# EAGLE design zephyreye_rev2 (EAGLE 5.06)
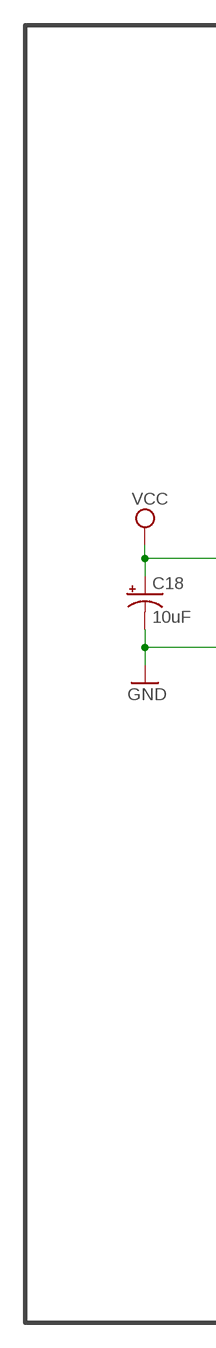
[diagram p0: schematic, sheet 1, part 1 of 2]
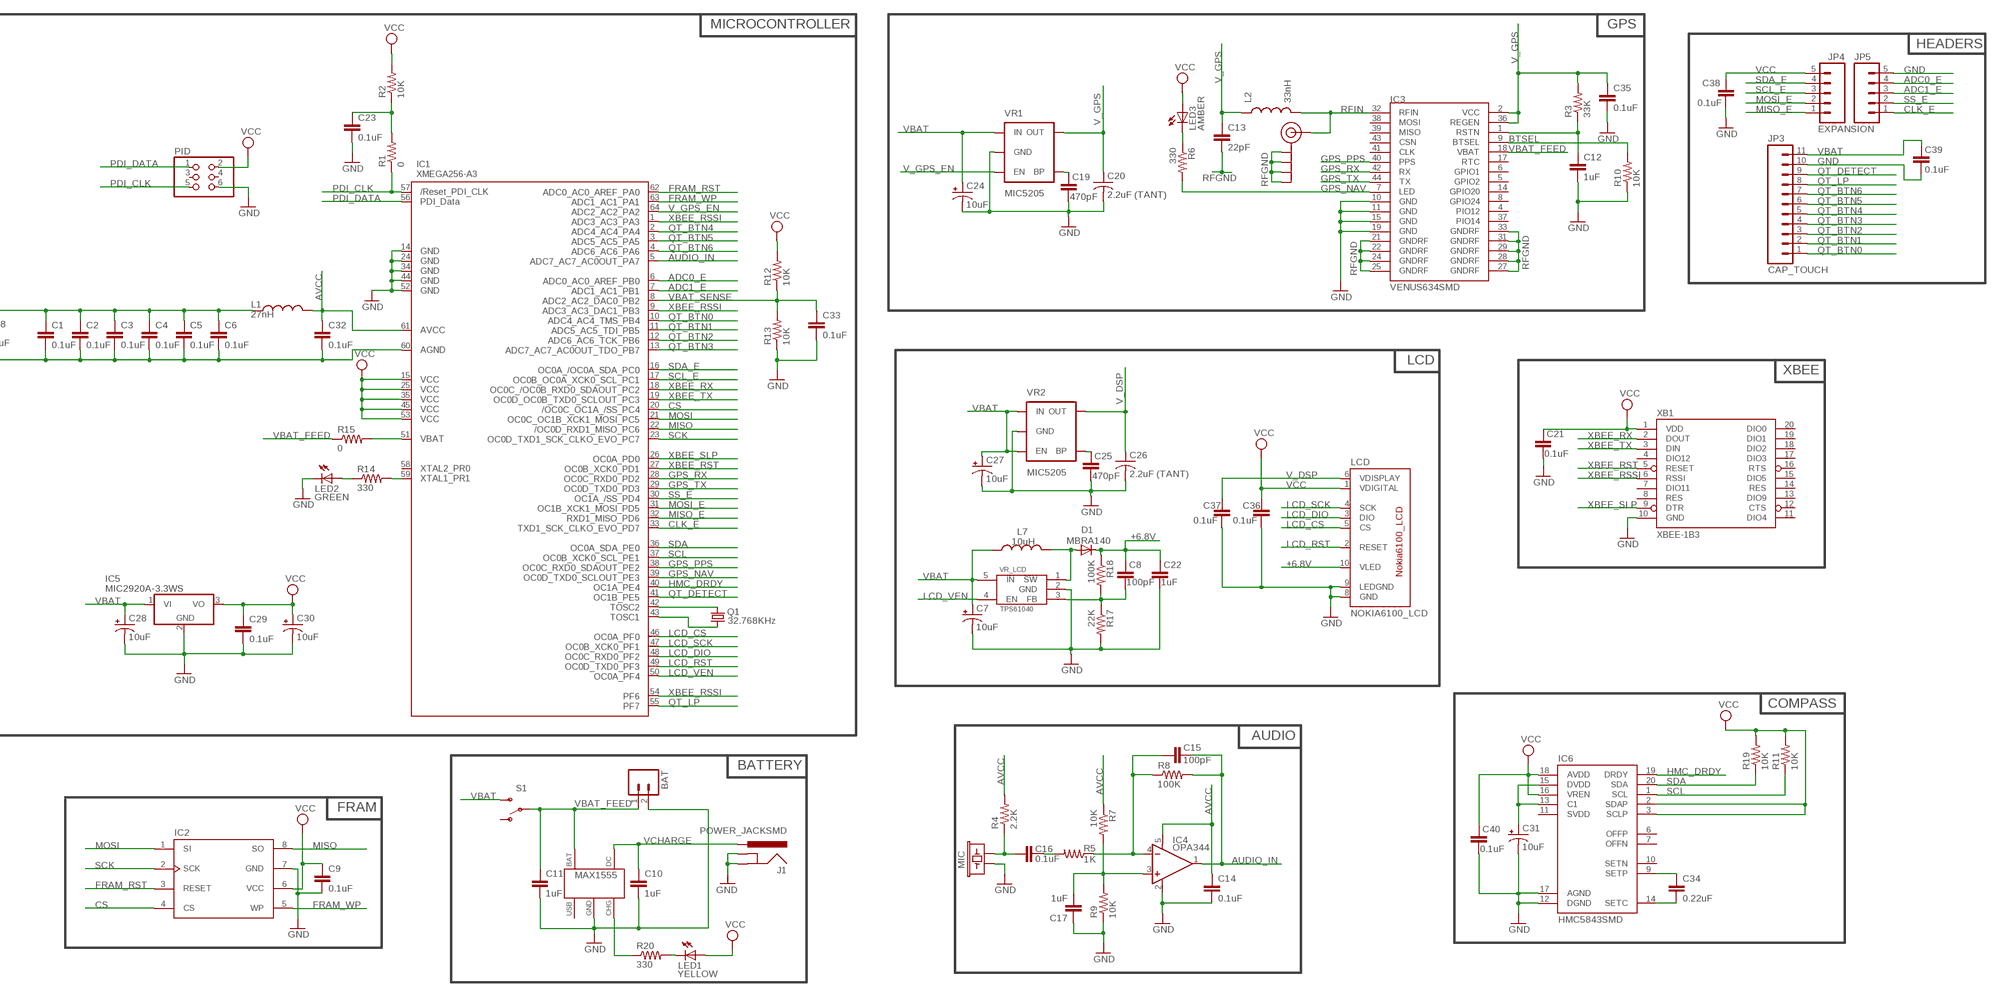
[diagram p1: schematic, sheet 1, part 2 of 2]

## Parts
ANT1  SMA_EDGE  [SMA-EDGE]
BAT  M02-JST-2MM-SMT  [S2B-PH]
C1  0.1uF  CAP0402  [C0402]
C2  0.1uF  CAP0402  [C0402]
C3  0.1uF  CAP0402  [C0402]
C4  0.1uF  CAP0402  [C0402]
C5  0.1uF  CAP0402  [C0402]
C6  0.1uF  CAP0402  [C0402]
C7  10uF  CAP_POL1206  [EIA3216]
C8  100pF  CAP0402  [C0402]
C9  0.1uF  CAP0402  [C0402]
C10  1uF  CAP0402  [C0402]
C11  1uF  CAP0402  [C0402]
C12  1uF  CAP0402  [C0402]
C13  22pF  CAP0402  [C0402]
C14  0.1uF  CAP0402  [C0402]
C15  100pF  CAP0402  [C0402]
C16  0.1uF  CAP0402  [C0402]
C17  1uF  CAP0402  [C0402]
C18  10uF  CAP_POL1206  [EIA3216]
C19  470pF  CAP0402  [C0402]
C20  2.2uF (TANT)  C-USC0603K  [C0603K]
C21  0.1uF  CAP0402  [C0402]
C22  1uF  CAP0402  [C0402]
C23  0.1uF  CAP0402  [C0402]
C24  10uF  CAP_POL1206  [EIA3216]
C25  470pF  CAP0402  [C0402]
C26  2.2uF (TANT)  C-USC0603K  [C0603K]
C27  10uF  CAP_POL1206  [EIA3216]
C28  10uF  CAP_POL1206  [EIA3216]
C29  0.1uF  CAP0402  [C0402]
C30  10uF  CAP_POL1206  [EIA3216]
C31  10uF  CAP_POL1206  [EIA3216]
C32  0.1uF  CAP0402  [C0402]
C33  0.1uF  CAP0402  [C0402]
C34  0.22uF  CAP0402  [C0402]
C35  0.1uF  CAP0402  [C0402]
C36  0.1uF  CAP0402  [C0402]
C37  0.1uF  CAP0402  [C0402]
C38  0.1uF  CAP0402  [C0402]
C39  0.1uF  CAP0402  [C0402]
C40  0.1uF  CAP0402  [C0402]
D1  MBRA140  DIODE-DO214AC  [DO214AC]
IC1  XMEGA256-A3  AVR_XMEGA_A3B_64A  [TQFP64]
IC2  FRAM  ATMEL_DATA_FLASH  [SO08WIDE]
IC3  VENUS634SMD  [LGA44]
IC4  OPA344  [SOT23-5]
IC5  MIC2920A-3.3WS  MCP1703DB  [SOT223]
IC6  HMC5843SMD  [LPCC20]
J1  POWER_JACKSMD  [POWER_JACK_SMD]
JP3  CAP_TOUCH  M111.27MM  [1X11-1.27MM]
JP4  EXPANSION  M051.27MM  [1X05-1.27MM]
JP5  M051.27MM  [1X05-1.27MM]
L1  27nH  INDUCTOR0402  [C0402]
L2  33nH  INDUCTOR0402  [C0402]
L7  10uH  INDUCTOR0603  [0603]
LCD  NOKIA6100_LCD  [NOKIA6100_LCD]
LED1  YELLOW  LED0603  [LED-0603]
LED2  GREEN  LED0603  [LED-0603]
LED3  AMBER  LED0603  [LED-0603]
MAX1555  MAX1555  [SOT23-5]
MIC  MIC9.7MM  [MIC-9.7MM]
PID  PINHD-2X3  [2X03]
Q1  32.768KHz  CRYSTAL32-SMD  [CRYSTAL-32KHZ-SMD]
R1  0  RESISTOR0402  [C0402]
R2  10K  RESISTOR0402  [C0402]
R3  33K  RESISTOR0402  [C0402]
R4  2.2K  RESISTOR0402  [C0402]
R5  1K  RESISTOR0402  [C0402]
R6  330  RESISTOR0402  [C0402]
R7  10K  RESISTOR0402  [C0402]
R8  100K  RESISTOR0402  [C0402]
R9  10K  RESISTOR0402  [C0402]
R10  10K  RESISTOR0402  [C0402]
R11  10K  RESISTOR0402  [C0402]
R12  10K  RESISTOR0402  [C0402]
R13  10K  RESISTOR0402  [C0402]
R14  330  RESISTOR0402  [C0402]
R15  0  RESISTOR0402  [C0402]
R17  22K  RESISTOR0402  [C0402]
R18  100K  RESISTOR0402  [C0402]
R19  10K  RESISTOR0402  [C0402]
R20  330  RESISTOR0402  [C0402]
S1  SWITCH-SPSTSMD2  [SWITCH-SPDT-SMD]
VR1  MIC5205  V_REG_LDOSMD  [SOT23-5]
VR2  MIC5205  V_REG_LDOSMD  [SOT23-5]
VR_LCD  TPS61040  [SOT23-5]
XB1  XBEE-1B3  [XBEE-SMD]

## Nets
+6.8V: C8.2 C22.2 D1.C LCD.10(VLED) R18.1
ADC0_E: IC1.6(PB0) JP5.4
ADC1_E: IC1.7(PB1) JP5.3
AUDIO_IN: C15.2 IC1.5(PA7) IC4.1(OUT) R8.2
AVCC: C14.1 C32.1 IC1.61(AVCC) IC4.5(V+) L1.2 R4.2 R7.1
BTSEL: IC3.9(BTSEL) R10.2
CHG: MAX1555.3(CHG) R20.1
CHRG_LED_FEED: LED1.C R20.2
CLK_E: IC1.33(PD7) JP5.1
CS: IC1.20(PC4) IC2.4(CS)
FRAM_RST: IC1.62(PA0) IC2.3(RESET)
FRAM_WP: IC1.63(PA1) IC2.5(WP)
GND: BAT.2 C1.2 C2.2 C3.2 C4.2 C5.2 C6.2 C7.C(-) C9.2 C10.2 C11.2 C12.2 C14.2 C17.1 C18.C(-) C19.2 C20.2 C21.2 C22.1 C23.2 C24.C(-) C25.2 C26.2 C27.C(-) C28.C(-) C29.2 C30.C(-) C31.C(-) C32.2 C33.2 C35.2 C36.1 C37.1 C38.2 C39.2 C40.2 IC1.14(GND1) IC1.24(GND2) IC1.34(GND3) IC1.44(GND4) IC1.52(GND5) IC1.60(AGND) IC2.7(GND) IC3.10(GND) IC3.11(GND) IC3.15(GND) IC3.19(GND) IC4.2(V-) IC5.2(GND) IC6.12(DGND) IC6.17(AGND) J1.GND(GNDBREAK) J1.P$4(GND) JP3.10 JP5.5 LCD.8(GND) LCD.9(LEDGND) LED2.C MAX1555.2(GND) MIC.1 PID.6 R9.1 R10.1 R13.1 R17.2 VR1.2(GND) VR2.2(GND) VR_LCD.2(GND) XB1.10(GND)
GPS_NAV: IC1.39(PE3) IC3.7(LED) R6.2
GPS_PPS: IC1.38(PE2) IC3.40(PPS)
GPS_RX: IC1.28(PD2) IC3.42(RX)
GPS_TX: IC1.29(PD3) IC3.44(TX)
HMC_DRDY: IC1.40(PE4) IC6.19(DRDY)
HMC_DVDD: C31.A(+) IC6.13(C1) IC6.15(DVDD)
HMC_SETC: C34.2 IC6.14(SETC)
HMC_SETP: C34.1 IC6.9(SETP)
LCD_CS: IC1.46(PF0) LCD.5(CS)
LCD_DIO: IC1.48(PF2) LCD.3(DIO)
LCD_RST: IC1.49(PF3) LCD.2(RESET)
LCD_SCK: IC1.47(PF1) LCD.4(SCK)
LCD_VEN: IC1.50(PF4) VR_LCD.4(EN)
LED3_FEED: LED3.C R6.1
MCU_LED: IC1.59(PR1) R14.2
MIC_FILT1: C16.2 R5.2
MIC_OPAMP_IN: C15.1 IC4.4(-IN) R5.1 R8.1
MIC_OPAMP_VIRT_GND: C17.2 IC4.3(+IN) R7.2 R9.2
MIC_RAW: C16.1 MIC.2 R4.1
MISO: IC1.22(PC6) IC2.8(SO)
MISO_E: IC1.32(PD6) JP4.1
MOSI: IC1.21(PC5) IC2.1(SI)
MOSI_E: IC1.31(PD5) JP4.2
N$1: IC1.51(VBAT) R15.2
N$3: LED2.A R14.1
PDI_CLK: IC1.57(RESET) PID.5 R1.1
PDI_DATA: IC1.56(PDI_DATA) PID.1
QT_BTN0: IC1.10(PB4) JP3.1
QT_BTN1: IC1.11(PB5) JP3.2
QT_BTN2: IC1.12(PB6) JP3.3
QT_BTN3: IC1.13(PB7) JP3.4
QT_BTN4: IC1.2(PA4) JP3.5
QT_BTN5: IC1.3(PA5) JP3.6
QT_BTN6: IC1.4(PA6) JP3.7
QT_DETECT: IC1.41(PE5) JP3.9
QT_LP: IC1.55(PF7) JP3.8
RFGND: ANT1.GND@0(GND) ANT1.GND@1(GND) ANT1.GND@2(GND) ANT1.GND@3(GND) C13.2 IC3.21(GNDRF) IC3.22(GNDRF) IC3.24(GNDRF) IC3.25(GNDRF) IC3.27(GNDRF) IC3.28(GNDRF) IC3.29(GNDRF) IC3.31(GNDRF) IC3.33(GNDRF)
RFIN: ANT1.SIG(SIGNAL) IC3.32(RFIN) L2.2
RST_FEED: C23.1 R1.2 R2.1
RSTN: C12.1 IC3.1(RSTN) R3.1
SCK: IC1.23(PC7) IC2.2(SCK)
SCL: IC1.37(PE1) IC6.1(SCL) R11.1
SCL_E: IC1.17(PC1) JP4.3
SDA: IC1.36(PE0) IC6.20(SDA) R19.1
SDA_E: IC1.16(PC0) JP4.4
SS_E: IC1.30(PD4) JP5.2
TOSC1: IC1.43(TOSC1) Q1.X1
TOSC2: IC1.42(TOSC2) Q1.X2
V_DSP: C26.1 C37.2 LCD.6(VDISPLAY) VR2.5(OUT)
V_GPS: C13.1 C20.1 C35.1 IC3.2(VCC) IC3.36(REGEN) L2.1 R3.2 VR1.5(OUT)
V_GPS_EN: IC1.64(PA2) VR1.3(EN)
VBAT: C7.A(+) C24.A(+) C27.A(+) C28.A(+) C39.1 IC5.1(VI) JP3.11 L7.1 S1.3(S) VR1.1(IN) VR2.1(IN) VR2.3(EN) VR_LCD.5(IN)
VBAT_FEED: BAT.1 C11.1 IC3.18(VBAT) MAX1555.5(BAT) R15.1 S1.2(P)
VBAT_SENSE: C33.1 IC1.8(PB2) R12.1 R13.2
VCC: C1.1 C2.1 C3.1 C4.1 C5.1 C6.1 C9.1 C18.A(+) C21.1 C29.1 C30.A(+) C36.2 C38.1 C40.1 IC1.15(VCC1) IC1.25(VCC2) IC1.35(VCC3) IC1.45(VCC4) IC1.53(VCC5) IC2.6(VCC) IC5.3(VO) IC6.2(SDAP) IC6.3(SCLP) IC6.16(VREN) IC6.18(AVDD) JP4.5 L1.1 LCD.1(VDIGITAL) LED1.A LED3.A PID.2 R2.2 R11.2 R12.2 R19.2 XB1.1(VDD)
VCHARGE: C10.1 J1.VIN0(PWR) MAX1555.4(DC)
VR1_BP: C19.1 VR1.4(BP)
VR1_BP1: C25.1 VR2.4(BP)
VR_LCD_FB: C8.1 R17.1 R18.2 VR_LCD.3(FB)
VR_LCD_SW: D1.A L7.2 VR_LCD.1(SW)
XBEE_RSSI: IC1.1(PA3) IC1.9(PB3) IC1.54(PF6) XB1.6(RSSI)
XBEE_RST: IC1.27(PD1) XB1.5(RESET)
XBEE_RX: IC1.18(PC2) XB1.2(DOUT)
XBEE_SLP: IC1.26(PD0) XB1.9(DTR)
XBEE_TX: IC1.19(PC3) XB1.3(DIN)
Unconnected: IC1.58(PR0) IC3.4(PIO12) IC3.5(GPIO2) IC3.6(GPIO1) IC3.8(GPIO24) IC3.14(GPIO20) IC3.17(RTC) IC3.37(PIO14) IC3.38(MOSI) IC3.39(MISO) IC3.41(CLK) IC3.43(CSN) IC6.6(OFFP) IC6.7(OFFN) IC6.10(SETN) IC6.11(SVDD) MAX1555.1(USB) PID.3 PID.4 S1.1(O) XB1.4(DIO12) XB1.7(DIO11) XB1.8(RES) XB1.11(DIO4) XB1.12(CTS) XB1.13(DIO9) XB1.14(RES) XB1.15(DIO5) XB1.16(RTS) XB1.17(DIO3) XB1.18(DIO2) XB1.19(DIO1) XB1.20(DIO0)

## Notes on the sheet
- MICROCONTROLLER | GPS
- HEADERS
- LCD
- XBEE
- COMPASS
- AUDIO
- BATTERY
- FRAM

## Library data of the parts
ANT1 = SparkFun:SMA_EDGE: SMA Antenna Connector End launch SMA connector. The paste layer has been removed so that the connector can be hand soldered onto the board after reflow.
BAT = SparkFun:M02: Header 2 Standard 2-pin 0.1" header. Use with straight break away headers (SKU : PRT-00116), right angle break away headers (PRT-00553), swiss pins (PRT-00743), machine pins (PRT-00117), and female headers (PRT-00115). Molex polarized connector foot print use with SKU : PRT-08233 with associated crimp pins and housings.
C1-C6 C8-C17 C19 C21-C23 C25 C29 C32-C40 = SparkFun:CAP: Capacitor Standard 0603 ceramic capacitor, and 0.1" leaded capacitor.
C7 C24 C27 C28 C30 C31 = SparkFun-3-2-07:CAP_POL: Capacitor Polarized These are standard SMD and PTH capacitors. Normally 10uF, 47uF, and 100uF in electrolytic and tantalum varieties. Always verify the external diameter of the through hole cap, it varies with capacity, voltage, and manufacturer. The EIA devices should be standard.
C18 = SparkFun:CAP_POL: Capacitor Polarized These are standard SMD and PTH capacitors. Normally 10uF, 47uF, and 100uF in electrolytic and tantalum varieties. Always verify the external diameter of the through hole cap, it varies with capacity, voltage, and manufacturer. The EIA devices should be standard.
C20 C26 = rcl:C-US: CAPACITOR, American symbol
D1 = diode:DIODE-: DIODE
IC1 = xmega:AVR_XMEGA_A3B_: Device for Atmel AVR XMEGA A3B Series
IC2 = SparkFunEagle-6-6-07:ATMEL_DATA_FLASH: 16Mbit EEPROM DataFlash Footprint needs touching up. Spark Fun Electronics SKU : COM-00301
IC3 = SparkFun:VENUS634: Venus634 from SkyTraq
IC4 = SparkFun:OPA344
IC5 = linear:MCP1703: 250 mA, 16V, Low Quiescent Current LDO Regulator Source: http://ww1.microchip.com/downloads/en/DeviceDoc/22049b.pdf
IC6 = SparkFun:HMC5843
J1 = SparkFun:POWER_JACK: Power Jack This is the standard 5.5mm barrel jack for power. The PTH is the most common, proven, reliable, footprint. All others are experimental. The Slot footprint only works if the mill layer is transmitted to the PCB fab house so be warned. Spark Fun Electronics SKU : PRT-00119. Mating wall wart : TOL-00298 (and others)
JP3 = SparkFun:M11: Header 11 Standard 11-pin 0.1" header. Use with straight break away headers (SKU : PRT-00116), right angle break away headers (PRT-00553), swiss pins (PRT-00743), machine pins (PRT-00117), and female headers (PRT-00115).
JP4 JP5 = SparkFun:M05: Header 5 Standard 5-pin 0.1" header. Use with straight break away headers (SKU : PRT-00116), right angle break away headers (PRT-00553), swiss pins (PRT-00743), machine pins (PRT-00117), and female headers (PRT-00115). Molex polarized connector foot print use with SKU : PRT-08230 with associated crimp pins and housings.
L1 L2 = SparkFun:INDUCTOR: Inductors Basic Inductor/Choke - 0603 and 1206. Footprints are not proven and vary greatly between part numbers.
L7 = SparkFun-3-2-07:INDUCTOR: Inductors Basic Inductor/Choke - 0603 and 1206. Footprints are not proven and vary greatly between part numbers.
LCD = SparkFun:NOKIA6100_LCD: Nokia 6100 Color LCD Schematic element and footprint production proven but could use some touching up. Spark Fun Electronics SKU : LCD-00569. Mating SMD connector : LCD-00570
LED1-LED3 = SparkFun:LED: LEDs Standard schematic elements and footprints for 5mm, 3mm, 1206, and 0603 sized LEDs. 5mm - Spark Fun Electronics SKU : COM-00529 (and others)
MAX1555 = brad:MAX1555
MIC = SparkFun:MIC: Microphone Omni-directional electret microphone. 9.7mm standard diameter.
PID = pinhead:PINHD-2X3: PIN HEADER
Q1 = SparkFun:CRYSTAL: Crystals Various standard crystals. Proven footprints. Spark Fun Electronics SKU : COM-00534
R1-R15 R17-R20 = SparkFun:RESISTOR: Resistor Basic schematic elements and footprints for 0603, 1206, and PTH 1/10th watt (small) resistors.
S1 = SparkFun:SWITCH-SPST: SPST Switch Simple slide switch. Spark Fun Electronics SKU : COM-00102
VR1 VR2 = SparkFun-3-2-07:V_REG_LDO: Voltage Regulator LDO Standard 150mA LDO voltage regulator in SOT-23 layout. Micrel part MIC5205. BP (by-pass) pin is used to lower output noise with 470pF cap.
VR_LCD = brad:TPS61040
XB1 = SparkFun:XBEE-1

## Board
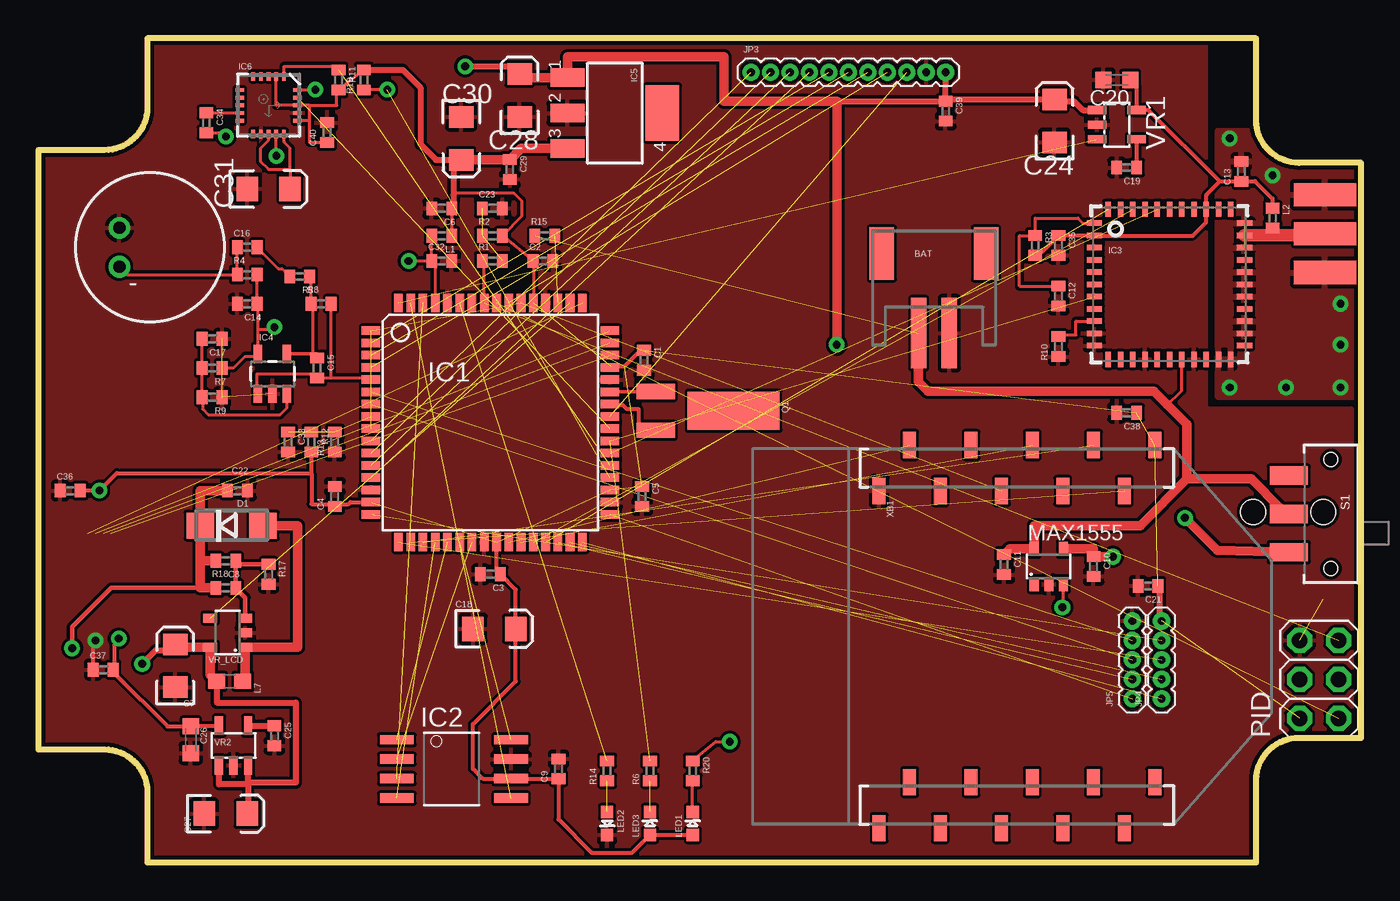
[diagram p2: board, top side]
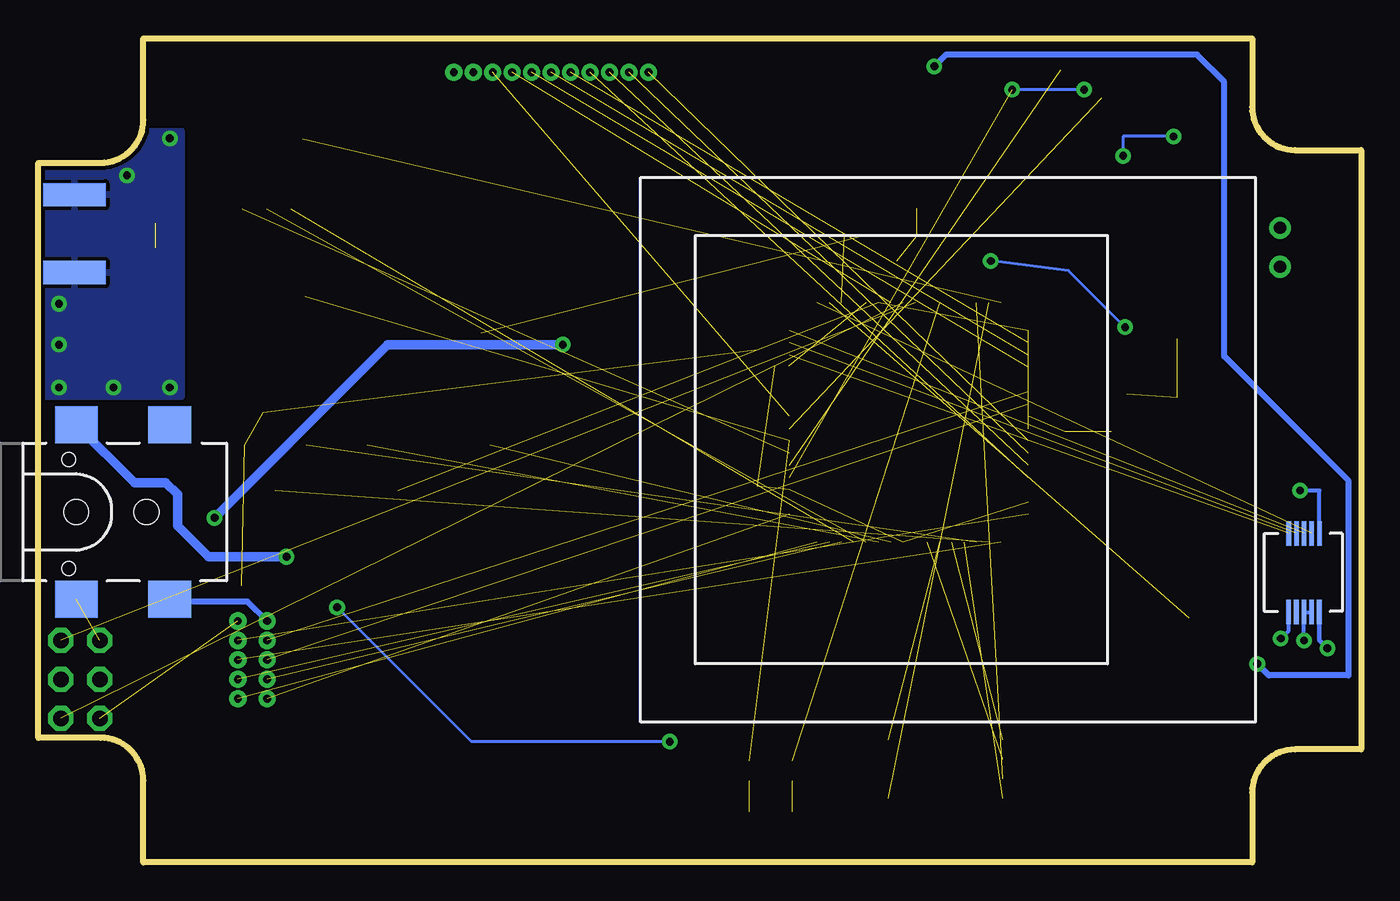
[diagram p3: board, bottom side, seen from below]

Size 86.36 x 53.77 mm. Coordinates in mm from the lower left corner, seen from the top.
Outline: 86.36,8.13 86.36,45.64 82.3,45.64 arc-90 79.5,48.44 79.5,53.77 7.12,53.77 7.12,49.29 arc-90 4.32,46.48 0,46.48 0,7.37 4.32,7.37 arc-90 7.12,4.56 7.12,0 79.5,0 79.5,5.33 arc-90 82.3,8.13 86.36,8.13
Copper layers (1*16): Top 0.035mm / dielectric 1.5mm / Bottom 0.035mm
Design rules "SparkFun": minimum track width 8mil, minimum drill 20mil, track to track 8mil, track to pad 8mil, pad to pad 8mil, via to via 8mil, smd to smd 8mil, copper to edge 10mil, drill to drill 8mil, minimum pad ring 12mil, minimum via ring 10mil, stop-mask expansion 4mil, vias tented up to drill 25mil, thermal gap 10mil

### Footprints (pad centres in the part's own frame; a part is rotated, then mirrored left to right if it is on the bottom)
SMA-EDGE = smd 1.524 x 4.064: GND@0 0,0; GND@1 5.08,0; SIG 2.54,0 | smd 1.524 x 4.064 bottom: GND@2 0,0; GND@3 5.08,0
S2B-PH = smd 1 x 4.6: 1 -1,-3.7; 2 1,-3.7 | smd 1.6 x 3.4: NC1 -3.4,1.5; NC2 3.4,1.5
C0402 = smd 0.7 x 0.9: 1 -0.65,0; 2 0.65,0
EIA3216 = smd 1.4 x 1.6: A 1.4,0; C -1.4,0
C0603K = smd 1.05 x 1.08: 1 -0.875,0; 2 0.875,0
DO214AC = smd 1.8 x 1.7: A 2.05,0; C -2.05,0
TQFP64 = smd 1.194 x 0.559: 1 -7.8,6; 2 -7.8,5.2; 3 -7.8,4.4; 4 -7.8,3.6; 5 -7.8,2.8; 6 -7.8,2; 7 -7.8,1.2; 8 -7.8,0.4; 9 -7.8,-0.4; 10 -7.8,-1.2; 11 -7.8,-2; 12 -7.8,-2.8; 13 -7.8,-3.6; 14 -7.8,-4.4; 15 -7.8,-5.2; 16 -7.8,-6; 33 7.8,-6; 34 7.8,-5.2; 35 7.8,-4.4; 36 7.8,-3.6; 37 7.8,-2.8; 38 7.8,-2; 39 7.8,-1.2; 40 7.8,-0.4; 41 7.8,0.4; 42 7.8,1.2; 43 7.8,2; 44 7.8,2.8; 45 7.8,3.6; 46 7.8,4.4; 47 7.8,5.2; 48 7.8,6 | smd 0.559 x 1.194: 17 -6,-7.8; 18 -5.2,-7.8; 19 -4.4,-7.8; 20 -3.6,-7.8; 21 -2.8,-7.8; 22 -2,-7.8; 23 -1.2,-7.8; 24 -0.4,-7.8; 25 0.4,-7.8; 26 1.2,-7.8; 27 2,-7.8; 28 2.8,-7.8; 29 3.6,-7.8; 30 4.4,-7.8; 31 5.2,-7.8; 32 6,-7.8; 49 6,7.8; 50 5.2,7.8; 51 4.4,7.8; 52 3.6,7.8; 53 2.8,7.8; 54 2,7.8; 55 1.2,7.8; 56 0.4,7.8; 57 -0.4,7.8; 58 -1.2,7.8; 59 -2,7.8; 60 -2.8,7.8; 61 -3.6,7.8; 62 -4.4,7.8; 63 -5.2,7.8; 64 -6,7.8
SO08WIDE = smd 0.61 x 2.21: 1 -1.905,-3.569; 2 -0.635,-3.569; 3 0.635,-3.569; 4 1.905,-3.569; 5 1.905,3.886; 6 0.635,3.886; 7 -0.635,3.886; 8 -1.905,3.886
LGA44 = smd 1 x 0.36: 1 -4.9,4; 2 -4.9,3.2; 3 -4.9,2.4; 4 -4.9,1.6; 5 -4.9,0.8; 6 -4.9,0; 7 -4.9,-0.8; 8 -4.9,-1.6; 9 -4.9,-2.4; 10 -4.9,-3.2; 11 -4.9,-4; 23 4.9,-4; 24 4.9,-3.2; 25 4.9,-2.4; 26 4.9,-1.6; 27 4.9,-0.8; 28 4.9,0; 29 4.9,0.8; 30 4.9,1.6; 31 4.9,2.4; 32 4.9,3.2; 33 4.9,4 | smd 0.36 x 1: 12 -4,-4.9; 13 -3.2,-4.9; 14 -2.4,-4.9; 15 -1.6,-4.9; 16 -0.8,-4.9; 17 0,-4.9; 18 0.8,-4.9; 19 1.6,-4.9; 20 2.4,-4.9; 21 3.2,-4.9; 22 4,-4.9; 34 4,4.9; 35 3.2,4.9; 36 2.4,4.9; 37 1.6,4.9; 38 0.8,4.9; 39 0,4.9; 40 -0.8,4.9; 41 -1.6,4.9; 42 -2.4,4.9; 43 -3.2,4.9; 44 -4,4.9
SOT23-5 = smd 0.55 x 1.2: 1 -0.95,-1.3; 2 0,-1.3; 3 0.95,-1.3; 4 0.95,1.3; 5 -0.95,1.3
SOT223 = smd 1.219 x 2.235: 1 -2.311,-3.099; 2 0,-3.099; 3 2.311,-3.099 | smd 3.6 x 2.2: 4 0,3.099
LPCC20 = smd 0.25 x 0.56: 1 1,1.88; 2 0.5,1.88; 3 0,1.88; 4 -0.5,1.88; 5 -1,1.88; 11 -1,-1.88; 12 -0.5,-1.88; 13 0,-1.88; 14 0.5,-1.88; 15 1,-1.88 | smd 0.56 x 0.25: 6 -1.88,1; 7 -1.88,0.5; 8 -1.88,0; 9 -1.88,-0.5; 10 -1.88,-1; 16 1.88,-1; 17 1.88,-0.5; 18 1.88,0; 19 1.88,0.5; 20 1.88,1
POWER_JACK_SMD = smd 2.8 x 2.4: GND 0,-5.7; P$4 6.1,-5.7; VIN0 0,5.7; VIN1 6.1,5.7 | hole 1.6: 0,0; 4.572,0
1X11-1.27MM = drill 0.508 pad 1 round: 1 0,0; 2 1.27,0; 3 2.54,0; 4 3.81,0; 5 5.08,0; 6 6.35,0; 7 7.62,0; 8 8.89,0; 9 10.16,0; 10 11.43,0; 11 12.7,0
1X05-1.27MM = drill 0.508 pad 1 round: 1 0,0; 2 1.27,0; 3 2.54,0; 4 3.81,0; 5 5.08,0
0603 = smd 1.1 x 1: 1 -0.85,0; 2 0.85,0
NOKIA6100_LCD = smd 1.6 x 0.3: 1 24.255,44.311; 2 24.255,43.811; 3 24.255,43.311; 4 24.255,42.811; 5 24.255,42.311; 6 29.389,42.303; 7 29.389,42.803; 8 29.389,43.303; 9 29.389,43.803; 10 29.389,44.303
LED-0603 = smd 0.8 x 0.8: A 0,-0.75; C 0,0.75
SOT23-5' = smd 0.6 x 0.9: 1 -0.95,-1.15; 2 0,-1.15; 3 0.95,-1.15; 4 0.95,1.15; 5 -0.95,1.15
MIC-9.7MM = drill 0.8 round: 1 -2,1.27; 2 -2,-1.27
2X03 = drill 1.016 octagon: 1 -2.54,-1.27; 2 -2.54,1.27; 3 0,-1.27; 4 0,1.27; 5 2.54,-1.27; 6 2.54,1.27
CRYSTAL-32KHZ-SMD = smd 2.5 x 6: SHEILD 0,5.08 | smd 1 x 2.5: X1 -1.27,0; X2 1.27,0
SWITCH-SPDT-SMD = smd 1.2 x 2.5: 1 -2.5,-2.75; 2 0,-2.75; 3 2.5,-2.75 | hole 0.9: -3.55,0; 3.55,0
XBEE-SMD = smd 1.7 x 0.85: 1 -12.5,20; 2 -9.5,18; 3 -12.5,16; 4 -9.5,14; 5 -12.5,12; 6 -9.5,10; 7 -12.5,8; 8 -9.5,6; 9 -12.5,4; 10 -9.5,2; 11 12.5,2; 12 9.5,4; 13 12.5,6; 14 9.5,8; 15 12.5,10; 16 9.5,12; 17 12.5,14; 18 9.5,16; 19 12.5,18; 20 9.5,20

### Placement (x,y rotation side)
ANT1  84,38.48 90 top
BAT  58.47,38.23 0 top
C1  39.55,32.77 270 top
C2  32.94,39.24 0 top
C3  29.51,18.8 180 top
C4  19.35,23.88 90 top
C5  39.42,23.88 270 top
C6  26.34,42.67 180 top
C7  8.94,12.83 90 top
C8  12.24,19.68 180 top
C9  33.96,6.1 90 top
C10  68.88,19.3 270 top
C11  63.04,19.43 270 top
C12  66.6,36.96 270 top
C13  78.54,45.09 90 top
C14  13.64,36.45 180 top
C15  18.21,32.26 270 top
C16  13.64,40.13 0 top
C17  11.35,34.16 180 top
C18  29.77,15.24 0 top
C19  71.04,45.34 180 top
C20  70.41,51.05 180 top
C21  72.44,18.03 180 top
C22  13,24.26 180 top
C23  29.64,42.67 0 top
C24  66.34,48.39 90 top
C25  15.42,8.26 270 top
C26  9.96,8 270 top
C27  12.24,3.17 0 top
C28  31.42,50.04 90 top
C29  30.78,45.21 270 top
C30  27.61,47.24 270 top
C31  15.04,43.94 0 top
C32  26.34,39.24 0 top
C33  16.31,27.43 270 top
C34  10.97,48.26 270 top
C35  66.6,40.26 270 top
C36  2.08,24.26 0 top
C37  4.24,12.57 0 top
C38  71.04,29.34 180 top
C39  59.23,49.02 270 top
C40  18.85,47.62 90 top
D1  12.62,21.97 0 top
IC1  29.51,28.7 0 top
IC2  26.97,6.1 270 top
IC3  73.84,37.72 0 top
IC4  15.29,31.88 0 top
IC5  37.64,48.9 270 top
IC6  15.04,49.4 0 top
J1  83.87,22.86 0 bottom
JP3  46.53,51.56 0 top
JP4  73.33,10.67 90 top
JP5  71.42,10.67 90 top
L1  26.34,40.89 180 top
L2  80.57,42.04 270 top
L7  12.5,11.81 0 top
LCD  47.04,45.72 270 bottom
LED1  42.72,2.54 0 top
LED2  37.13,2.54 180 top
LED3  39.93,2.54 0 top
MAX1555  MAX1555  [SOT23-5']  65.96,19.3 0 top
MIC  7.29,40.13 0 top
PID  83.62,11.94 90 top
Q1  40.31,29.46 270 top
R1  29.64,39.24 0 top
R2  29.64,40.89 0 top
R3  65.07,40.26 270 top
R4  13.64,38.35 0 top
R5  17.07,38.23 180 top
R6  39.93,5.97 90 top
R7  11.35,32.26 180 top
R8  18.47,36.45 0 top
R9  11.35,30.35 180 top
R10  66.6,33.66 90 top
R11  19.61,51.05 270 top
R12  17.83,27.43 270 top
R13  19.35,27.43 90 top
R14  37.13,5.97 90 top
R15  33.07,40.89 0 top
R17  15.04,18.8 270 top
R18  12.24,17.91 0 top
R19  21.26,51.05 90 top
R20  42.72,5.97 270 top
S1  84.38,22.73 270 top
VR1  70.41,48.13 270 top
VR2  12.75,7.62 0 top
VR_LCD  TPS61040  [SOT23-5']  12.37,14.99 90 top
XB1  52.88,14.73 270 top

### Tracks (layer width: path | path; a pad name or v marks a point on that pad's centre or on a via)
+6.8V  (via drill 0.51)
  Top 0.305: v2.21,13.97 2.21,15.37 4.75,17.91 10.57,17.91
  Top 0.61: C22.2 10.57,24.26 D1.C 10.57,19.68 | 10.57,19.68 C8.2 | R18.1 10.57,17.91 10.57,19.68
  Bottom 0.305: LCD.10 2.74,14.5 v2.21,13.97
ADC0_E  (1 unrouted)
ADC1_E  (1 unrouted)
AUDIO_IN
  Top 0.203: 19.12,31.61 R8.2 | 19.12,31.61 C15.2 18.21,31.88 14.27,31.88 14.27,30.58 IC4.1 | IC1.5 21.71,31.61 19.12,31.61
AVCC  (via drill 0.51)
  Top 0.203: C32.1 25.91,39.02 IC1.61 | C32.1 L1.2 | R7.1 12.75,32.26 13.51,33.02 14.18,33.02 IC4.5 14.34,34.8 | 14.34,34.8 14.34,36.4 C14.1 R4.2 | v24.18,39.24 C32.1 | v15.42,34.92 15.29,34.8 14.34,34.8
  Bottom 0.203: v24.18,39.24 19.1,38.61 v15.42,34.92
BTSEL
  Top 0.203: IC3.9 67.74,35.32 67.74,34.42 66.6,34.42 R10.2
CHG  (via drill 0.51)
  Top 0.203: MAX1555.3 66.91,16.7 v66.85,16.64 | v45.14,7.87 44.23,7.87 R20.1
  Bottom 0.203: v66.85,16.64 58.09,7.87 v45.14,7.87
CHRG_LED_FEED
  Top 0.203: LED1.C R20.2
CLK_E  (1 unrouted)
CS  (1 unrouted)
FRAM_RST  (1 unrouted)
FRAM_WP  (1 unrouted)
GND  (via drill 0.51)  (3 unrouted)
  Top 0.254: v3.73,14.48 3.59,14.34 C37.1
  Bottom 0.254: LCD.9 LCD.8 v3.74,14.48 v3.73,14.48
  Bottom 0.406: J1.P$4 76.75,17.02 72.69,17.02 JP5.5
  pour Top: 0.18,0.13 85.78,0.13 85.78,29.59 76.25,29.59 76.25,53.59 0.18,53.47
GPS_NAV  (2 unrouted)
GPS_PPS  (1 unrouted)
GPS_RX  (1 unrouted)
GPS_TX  (1 unrouted)
HMC_DRDY  (1 unrouted)
HMC_DVDD
  Top 0.203: 16.44,45.21 C31.A | 16.44,45.21 16.44,46.61 16.05,46.99 16.05,47.51 IC6.15 | IC6.13 15.04,47.12 14.53,46.61 14.53,45.72 15.04,45.21 16.44,45.21
HMC_SETC  (via drill 0.51)
  Top 0.203: C34.2 12.24,47.61 v12.24,47.37 | v15.54,46.1 15.54,46.48 IC6.14
  Bottom 0.203: v12.24,47.37 15.54,47.37 v15.54,46.1
HMC_SETP
  Top 0.203: C34.1 IC6.9
LCD_CS  (1 unrouted)
LCD_DIO  (1 unrouted)
LCD_RST  (1 unrouted)
LCD_SCK  (1 unrouted)
LCD_VEN  (1 unrouted)
LED3_FEED  (1 unrouted)
MCU_LED  (1 unrouted)
MIC_FILT1
  Top 0.203: C16.2 14.29,40.12 15.67,38.73 15.91,38.73 R5.2
MIC_OPAMP_IN
  Top 0.203: R5.1 17.82,38.13 R8.1 17.96,36.31 17.96,33.18 IC4.4 18.21,33.18 C15.1
MIC_OPAMP_VIRT_GND
  Top 0.203: C17.2 R7.2 R9.2 10.72,30.34 10.72,29.59 11.1,29.21 15.8,29.21 16.24,29.65 IC4.3
MIC_RAW
  Top 0.203: C16.1 R4.1 5.8,38.35 MIC.2
MISO  (1 unrouted)
MISO_E  (1 unrouted)
MOSI  (1 unrouted)
MOSI_E  (1 unrouted)
N$1  (1 unrouted)
N$3  (1 unrouted)
PDI_CLK  (1 unrouted)
  Top 0.203: R1.1 29.11,39.12 IC1.57
PDI_DATA  (1 unrouted)
QT_BTN0  (1 unrouted)
QT_BTN1  (1 unrouted)
QT_BTN2  (1 unrouted)
QT_BTN3  (1 unrouted)
QT_BTN4  (1 unrouted)
QT_BTN5  (1 unrouted)
QT_BTN6  (1 unrouted)
QT_DETECT  (1 unrouted)
QT_LP  (1 unrouted)
RFGND  (via drill 0.51)  (1 unrouted)
  other vias: 77.77,47.24 80.57,44.83 85.01,36.45 85.01,33.78 85.01,30.99 81.46,30.99 77.77,30.99
  pour Top: 77.01,30.35 77.01,47.75 86.03,47.75 86.03,30.35
  pour Bottom: 77.01,47.75 77.01,30.35 86.03,30.35 86.03,47.75
RFIN
  Top 0.254: L2.2 80.31,41.05 80.19,40.92
  Top 0.813: IC3.32 80.19,40.92 83.62,40.92 ANT1.SIG
RST_FEED  (2 unrouted)
RSTN
  Top 0.203: C12.1 64.06,37.61 64.06,40.89 65.07,40.89 R3.1 65.07,42.04 67.87,42.04 68.19,41.72 IC3.1
SCK  (1 unrouted)
SCL  (1 unrouted)
  Top 0.203: R11.1 19.37,51.94 16.05,51.94 16.04,51.93 IC6.1
SCL_E  (1 unrouted)
SDA  (via drill 0.51)  (1 unrouted)
  Top 0.203: IC6.20 16.93,50.42 v18.08,50.42 | v22.78,50.42 22.77,50.4 R19.1
  Bottom 0.203: v18.08,50.42 v22.78,50.42
SDA_E  (1 unrouted)
SS_E  (1 unrouted)
TOSC1
  Top 0.254: IC1.43 Q1.X1
TOSC2
  Top 0.254: Q1.X2 39.17,28.19 39.17,29.59 38.4,29.59 38.15,29.84 37.37,29.84 IC1.42
V_DSP  (via drill 0.51)
  Top 0.254: VR2.5 10,8.92 C26.1 8.45,8.88 5,12.32 | v5.26,14.61 5.26,14.48 5,14.22 5,12.69 C37.2
  Top 0.406: 5,12.32 5,12.46 C37.2
  Bottom 0.254: LCD.6 4.74,15.12 v5.26,14.61
V_GPS
  Top 0.254: 77.12,44.44 C13.1 78.55,44.45 79.43,44.45 80.57,43.31 L2.1 | 77.12,44.44 76.25,43.56 76.25,42.63 IC3.36 76.24,41.77 75.36,40.89 68.96,40.89 IC3.2 C35.1 66.6,40.89 65.58,39.88 R3.2 | C20.1 71.71,50.63 VR1.5 72.48,49.08 77.12,44.44
V_GPS_EN  (1 unrouted)
VBAT  (via drill 0.51)
  Top 0.406: VR1.1 68.19,49.08 67.61,49.66 66.47,49.66 C24.A 59.38,49.79 C39.1 | C39.1 59.25,51.55 JP3.11 | 13.7,5.08 13.7,3.23 C27.A | 13.7,5.21 13.7,5.08 | 13.7,5.21 VR2.3 | VR2.1 11.8,5.08 13.7,5.08 | L7.1 11.65,10.41 16.81,10.41 16.81,5.21 13.7,5.21 | C39.1 59.23,49.66 51.99,49.66 | 31.65,51.21 30.91,51.94 v27.86,51.94 | v6.78,12.95 7.67,13.84 8.56,13.84 C7.A
  Top 0.61: L7.1 11.22,12.24 VR_LCD.5 9.13,14.04 C7.A | C28.A 31.65,51.21 IC5.1 34.54,52.58 44.75,52.58 44.75,49.66 51.99,49.66 52.12,49.66 52.12,34.67 | 52.12,34.67 52.12,34.29 | S1.3 76.97,20.36 v74.85,22.48 | 52.12,34.67 v52.12,33.78
  Bottom 0.406: v27.86,51.94 27.1,52.7 10.72,52.7 8.94,50.93 8.94,33.02 0.81,24.89 0.81,12.19 6.02,12.19 v6.78,12.95
  Bottom 0.61: v74.85,22.48 63.55,33.78 v52.12,33.78
VBAT_FEED  (1 unrouted)
  Top 0.203: IC3.18 74.64,30.77 73.71,29.84
  Top 0.61: 74.98,25.02 74.98,28.57 73.71,29.84 72.82,30.73 58.09,30.73 57.45,31.37 57.45,34.51 BAT.1 | C11.1 63.42,20.45 MAX1555.5 65.01,21.97 71.93,21.97 74.98,25.02 | 74.98,25.02 79.17,25.02 81.08,23.11 S1.2
VBAT_SENSE  (3 unrouted)
VCC  (via drill 0.51)  (9 unrouted)
  Top 0.203: C40.1 17.7,46.98 17.7,48.39 | 17.7,48.39 16.92,48.39 IC6.16 | 17.7,49.4 IC6.18 15.54,49.4 IC6.2 IC6.3 | 17.7,48.39 17.7,49.4 | 17.7,49.4 19.48,49.4 19.48,50.4 R11.2 R19.2 | IC1.53 32.31,39.22 C2.1 R2.2 31.55,42.15 31.55,43.18 31.04,43.69 27.23,43.69 27.1,43.56 | C6.1 L1.1
  Top 0.254: C1.1 39.31,33.42 38.28,32.38 37.4,32.38 IC1.45 | IC1.25 29.91,19.05 C3.1 31.17,17.79 C18.A 31.17,11.81 28.37,9.02 28.37,6.1 29.01,5.46 IC2.6 33.94,5.46 C9.1 33.96,2.79 36.12,0.64 38.77,0.64 LED3.A | LED3.A 39.92,1.78 | C36.2 v3.99,24.26 5.13,25.4 17.83,25.4 | 19.5,23.37 C4.1 | 19.5,23.37 20.24,23.37 20.38,23.5 IC1.15 | 19.5,23.37 17.83,23.37 17.83,25.4 | 17.83,25.4 R12.2 | LED3.A LED1.A
  Top 0.406: 27.1,45.86 27.88,45.86 | 27.1,45.86 27.1,43.56 27.1,42.78 C6.1 | R19.2 23.78,51.7 24.94,50.55 24.94,46.86 25.96,45.85 27.09,45.85 27.1,45.86 | C21.1 73.2,17.92 73.2,15.75 JP4.5
  Top 0.61: IC5.3 31.51,46.58 C29.1 27.88,45.86 C30.A
  Bottom 0.254: v3.99,24.26 C36.2 LCD.1
VCHARGE  (via drill 0.51)
  Top 0.61: MAX1555.4 68.88,20.45 C10.1 69.79,19.95 v70.15,19.94
  Bottom 0.61: v70.15,19.94 75.25,19.94 77.27,21.96 77.27,24 78.03,24.77 80.06,24.77 J1.VIN0
VR1_BP
  Top 0.254: VR1.4 71.71,45.35 C19.1
VR1_BP1
  Top 0.406: VR2.4 15.4,8.92 C25.1
VR_LCD_FB
  Top 0.305: VR_LCD.3 13.52,17.28 R18.2 C8.1 13.13,19.45 R17.1
VR_LCD_SW
  Top 0.61: L7.2 13.52,11.98 VR_LCD.1 16.94,14.04 16.94,21.97 D1.A
XBEE_RSSI  (3 unrouted)
XBEE_RST  (1 unrouted)
XBEE_RX  (1 unrouted)
XBEE_SLP  (1 unrouted)
XBEE_TX  (1 unrouted)